# Altium schematic sheet Magnetometer and Electromagnet Driver.SchDoc
size A; SheetNumber: 6; SheetTotal: 19
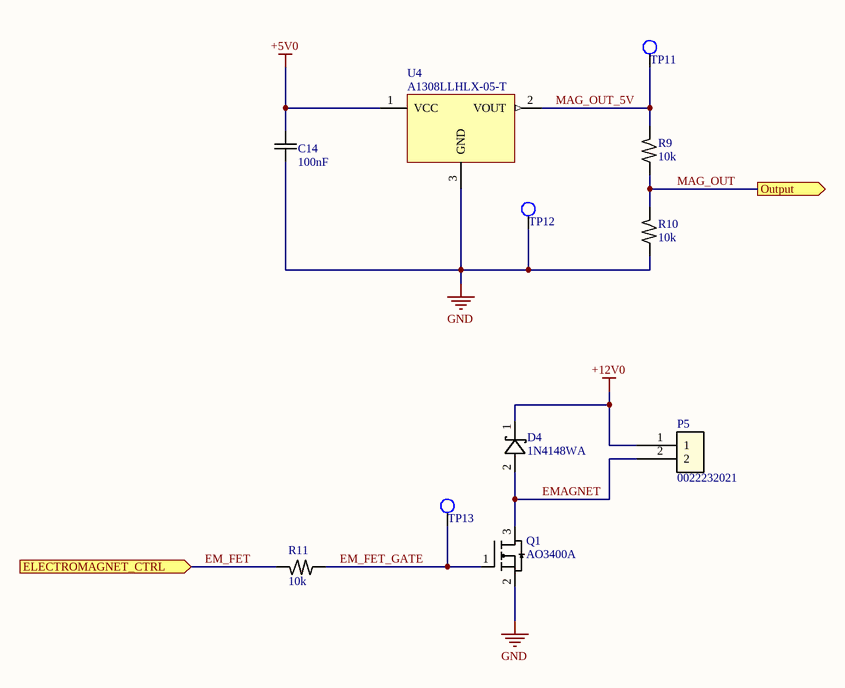
[diagram p0: Magnetometer and Electromagnet Driver.SchDoc]

## Parts
C14  100nF  [C0603]
D4  1N4148WA  [SOD-123W]
P5  0022232021  [Signal2]
Q1  AO3400A  [SOT23-3]
R9  10k  [R0603]
R10  10k  [R0603]
R11  10k  [R0603]
TP11  TestPoint  [TESTPOINT_SMD_1.27MM]  (value not drawn)  (no BOM)
TP12  TestPoint  [TESTPOINT_SMD_1.27MM]  (value not drawn)  (no BOM)
TP13  TestPoint  [TESTPOINT_SMD_1.27MM]  (value not drawn)  (no BOM)
U4  A1308LLHLX-05-T  [SOT23-3]

## Ports
ELECTROMAGNET_CTRL (in), Output (out)

## Nets
+5V0: C14.2 U4.1(VCC)
+12V0: D4.1 P5.1
GND: C14.1 Q1.2(G) R10.1 TP12.1 U4.3(GND)
EM_FET: R11.2 ; port ELECTROMAGNET_CTRL
EM_FET_GATE: Q1.1(G) R11.1 TP13.1
EMAGNET: D4.2 P5.2 Q1.3(G)
MAG_OUT: R9.1 R10.2 ; port Output
MAG_OUT_5V: R9.2 TP11.1 U4.2(VOUT)

## Notes on the sheet
- Project:
- Sheet Title:
- Size
- Date:
- A
- Sheet Number:
- Sheet Total:
- Revision:
- Time:
- Author:

## Library data of the parts
C14 = Cap_cer: CAP CER 100nF 50V X7R 0603; MF: HRE; MP: CGA0603X7R104K500JT; ComponentLink1Description: Datasheet; ComponentLink1URL: https://www.lcsc.com/datasheet/C6119867.pdf; ComponentLink2Description: Supplier1; ComponentLink2URL: https://www.lcsc.com/product-detail/C6119867.html
D4 = PMEG4020ETR-QX: DIODE GP 75V 150mA SOD-123W; MF: PJSEMI; MP: 1N4148WA; ComponentLink1Description: Datasheet; ComponentLink1URL: https://www.lcsc.com/datasheet/C2977359.pdf; ComponentLink2Description: Supplier1; ComponentLink2URL: https://www.lcsc.com/product-detail/C2977359.html
P5 = Signal2: SignalConnector, 2 leads; MF: Molex; ComponentLink1Description: Datasheet; ComponentLink1URL: https://www.molex.com/content/dam/molex/molex-dot-com/products/automated/en-us/salesdrawingpdf/637/6373/022232021_sd.pdf?inline; ComponentLink2Description: Supplier1; ComponentLink2URL: https://www.digikey.com/en/products/detail/molex/0022232021/26667; MP: 0022232021
Q1 = AO3400A: MOSFET N-CH 30V SOT-23-3L; MF: AOS; ComponentLink1Description: Supplier1; ComponentLink1URL: https://www.lcsc.com/product-detail/C20917.html; ComponentLink2Description: Datasheet; ComponentLink2URL: https://www.lcsc.com/datasheet/C20917.pdf; MP: AO3400A
R9-R11 = Res: RES 10kΩ ±1% 100mW 0603; MF: FOJAN; MP: FRC0603F1002TS; ComponentLink1Description: Datasheet; ComponentLink1URL: https://www.lcsc.com/datasheet/C2906982.pdf; ComponentLink2Description: Supplier1; ComponentLink2URL: https://www.lcsc.com/product-detail/C2906982.html
U4 = A1308LLHLX-05-T Magnetometer: SOT-23W Linear 0.5mV/Gauss, Compass (ICs) RoHS; MF: ALLEGRO; ComponentLink1Description: Datasheet; ComponentLink1URL: https://www.lcsc.com/datasheet/C2152984.pdf; ComponentLink2Description: Supplier1; ComponentLink2URL: https://www.lcsc.com/product-detail/C2152984.html?s_z=n_A1308LLHLX-05-T; MP: A1308LLHLX-05-T